# Altium schematic sheet drv8825.SchDoc
size A4
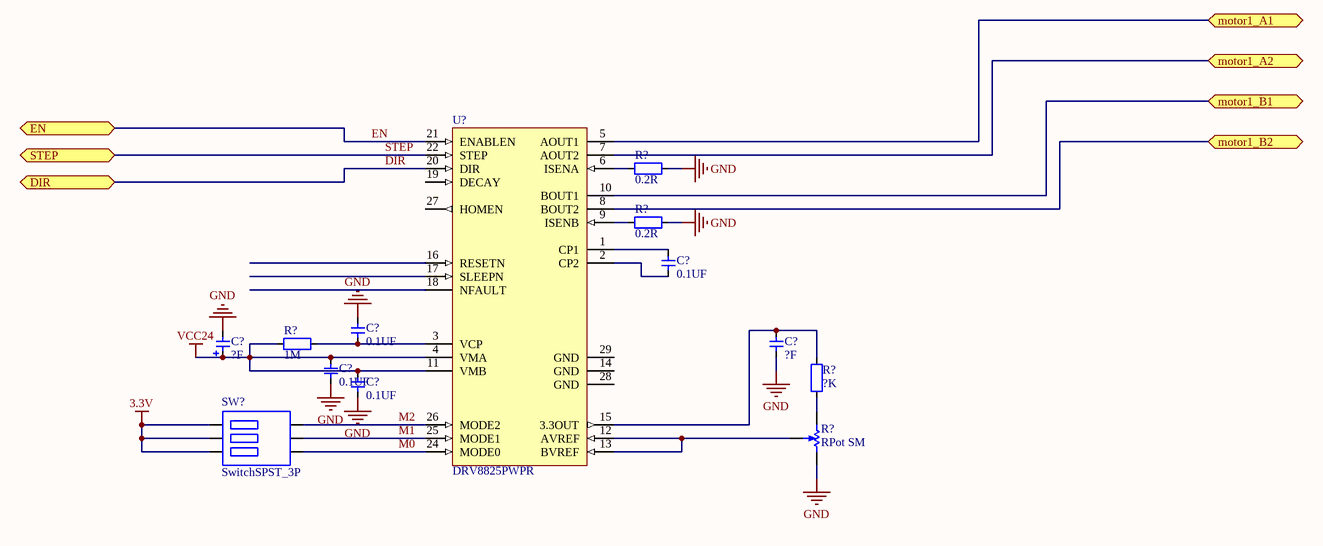
[diagram p0: drv8825.SchDoc]

## Parts
(Parts that share a designator on the sheet are numbered #1, #2 ... from top to bottom, then left to right.)
C?#1  value 0.1UF  [CAP_0603]  (hidden comment: Cap_0603)
C?#2  value 0.1UF  [CAP_0603]  (hidden comment: Cap_0603)
C?#3  value ?F  [CAP_0603]  (hidden comment: Cap_0603)
C?#4  value ?F  [CAPAE6666X77M]  (hidden comment: Cap_63*77)
C?#5  value 0.1UF  [CAP_0603]  (hidden comment: Cap_0603)
C?#6  value 0.1UF  [CAP_0603]  (hidden comment: Cap_0603)
R?#1  value 0.2R  [RES_0603]  (hidden comment: Res_0603)
R?#2  value 0.2R  [RES_0603]  (hidden comment: Res_0603)
R?#3  value 1M  [RES_0603]  (hidden comment: Res_0603)
R?#4  value ?K  [RES_0603]  (hidden comment: Res_0603)
R?#5  RPot SM  [POT4MM-2]
SW?  SwitchSPST_3P  [SwitchSPDT_P2_180]
U?  DRV8825PWPR  [PWP0028D_L]

## Ports
DIR, EN, motor1_A1, motor1_A2, motor1_B1, motor1_B2, STEP

## Nets
3.3V: SW?.1ON(ON) SW?.2ON(NO) SW?.3ON(NO)
GND: C?#2.2 C?#3.1 C?#4.2 C?#5.1 C?#6.1 R?#1.2 R?#2.2 R?#5.CW(+)
VCC24: C?#4.1 C?#5.2 C?#6.2 R?#3.1 U?.4(VMA) U?.11(VMB)
DIR: U?.20(DIR) ; port DIR
EN: U?.21(ENABLEN) ; port EN
M0: SW?.1(COMMON) U?.24(MODE0)
M1: SW?.2(COMMON) U?.25(MODE1)
M2: SW?.3(COMMON) U?.26(MODE2)
motor1_A1: U?.5(AOUT1) ; port motor1_A1
motor1_A2: U?.7(AOUT2) ; port motor1_A2
motor1_B1: U?.10(BOUT1) ; port motor1_B1
motor1_B2: U?.8(BOUT2) ; port motor1_B2
STEP: U?.22(STEP) ; port STEP
NetC?#1_1: C?#1.1 U?.2(CP2)
NetC?#1_2: C?#1.2 U?.1(CP1)
NetC?#2_1: C?#2.1 R?#3.2 U?.3(VCP)
NetC?#3_2: C?#3.2 R?#4.2 U?.15(3.3OUT)
NetR?#1_1: R?#1.1 U?.6(ISENA)
NetR?#2_1: R?#2.1 U?.9(ISENB)
NetR?#4_1: R?#4.1 R?#5.CCW(-)
NetR?#5_W: R?#5.W U?.12(AVREF) U?.13(BVREF)

Not connected (* = marked no-connect by the designer): U? 14(GND) 16(RESETN) 17(SLEEPN) 18(NFAULT) 19(DECAY) 27(HOMEN) 28(GND) 29(GND)

## Library data of the parts
C?#1-C?#3 C?#5 C?#6 = Cap_0603: Capacitor
C?#4 = Cap_Tan_0805: Capacitor
R?#1-R?#4 = Res_0603: Resistor
R?#5 = RPot SM: Square Trimming Potentiometer; Published: 17-Dec-2003; DatasheetVersion: Oct-2003; PackageReference: POT4MM-2; Publisher: Altium Limited; PackageDescription: Square Trimming Potentiometer; ComponentLink1Description: Manufacturer Link; ComponentLink1URL: http://bourns.com/2/search.html
SW? = SwitchSPST_3P: Switch
U? = TI-DRV8818PWP28-6405X2000TP: 2.5 A Bipolar Stepper Motor Driver with On-Chip 1/8 MicroStepping Indexer (Step / Dir Ctrl), 8 to 35 V, -40 to 85 degC, 28-pin SOP (PWP28), Green (RoHS & no Sb/Br); PartNumber: DRV8818PWPR; Peak Output Current(A): 2.5; Vs(Max)(V): 35; RMS Output Current(A): 1.75; Vs(Min)(V): 8; rDS (ON) (LS + HS)(mOhms): 370; ComponentLink1URL: http://www.ti.com/; PackageDescription: 28-Pin Plastic Small Outline, Body 4.4 x 9.7 mm, Pitch 0.65 mm; Package Reference: PWP0028D; ComponentLink1Description: Manufacturer URL; ComponentLink2Description: Datasheet; Code_JEDEC: MO-153; ComponentLink2URL: http://www.ti.com/general/docs/lit/getliterature.tsp?genericPartNumber=DRV8818&fileType=pdf; DatasheetVersion: SLVSAX9B; ComponentLink3Description: Package Specification; Mounting Technology: Surface Mount; Eco-Plan: Green (RoHS & no Sb/Br); ComponentLink3URL: http://www.ti.com/litv/pdf/mpds373; PackageVersion: 4073225-6/I, 05/2011; Control I/F: INDEXER